# EAGLE design CoffeeRoaster_FrontPanelBoard_2023_02_25_A (EAGLE 9.6.1)
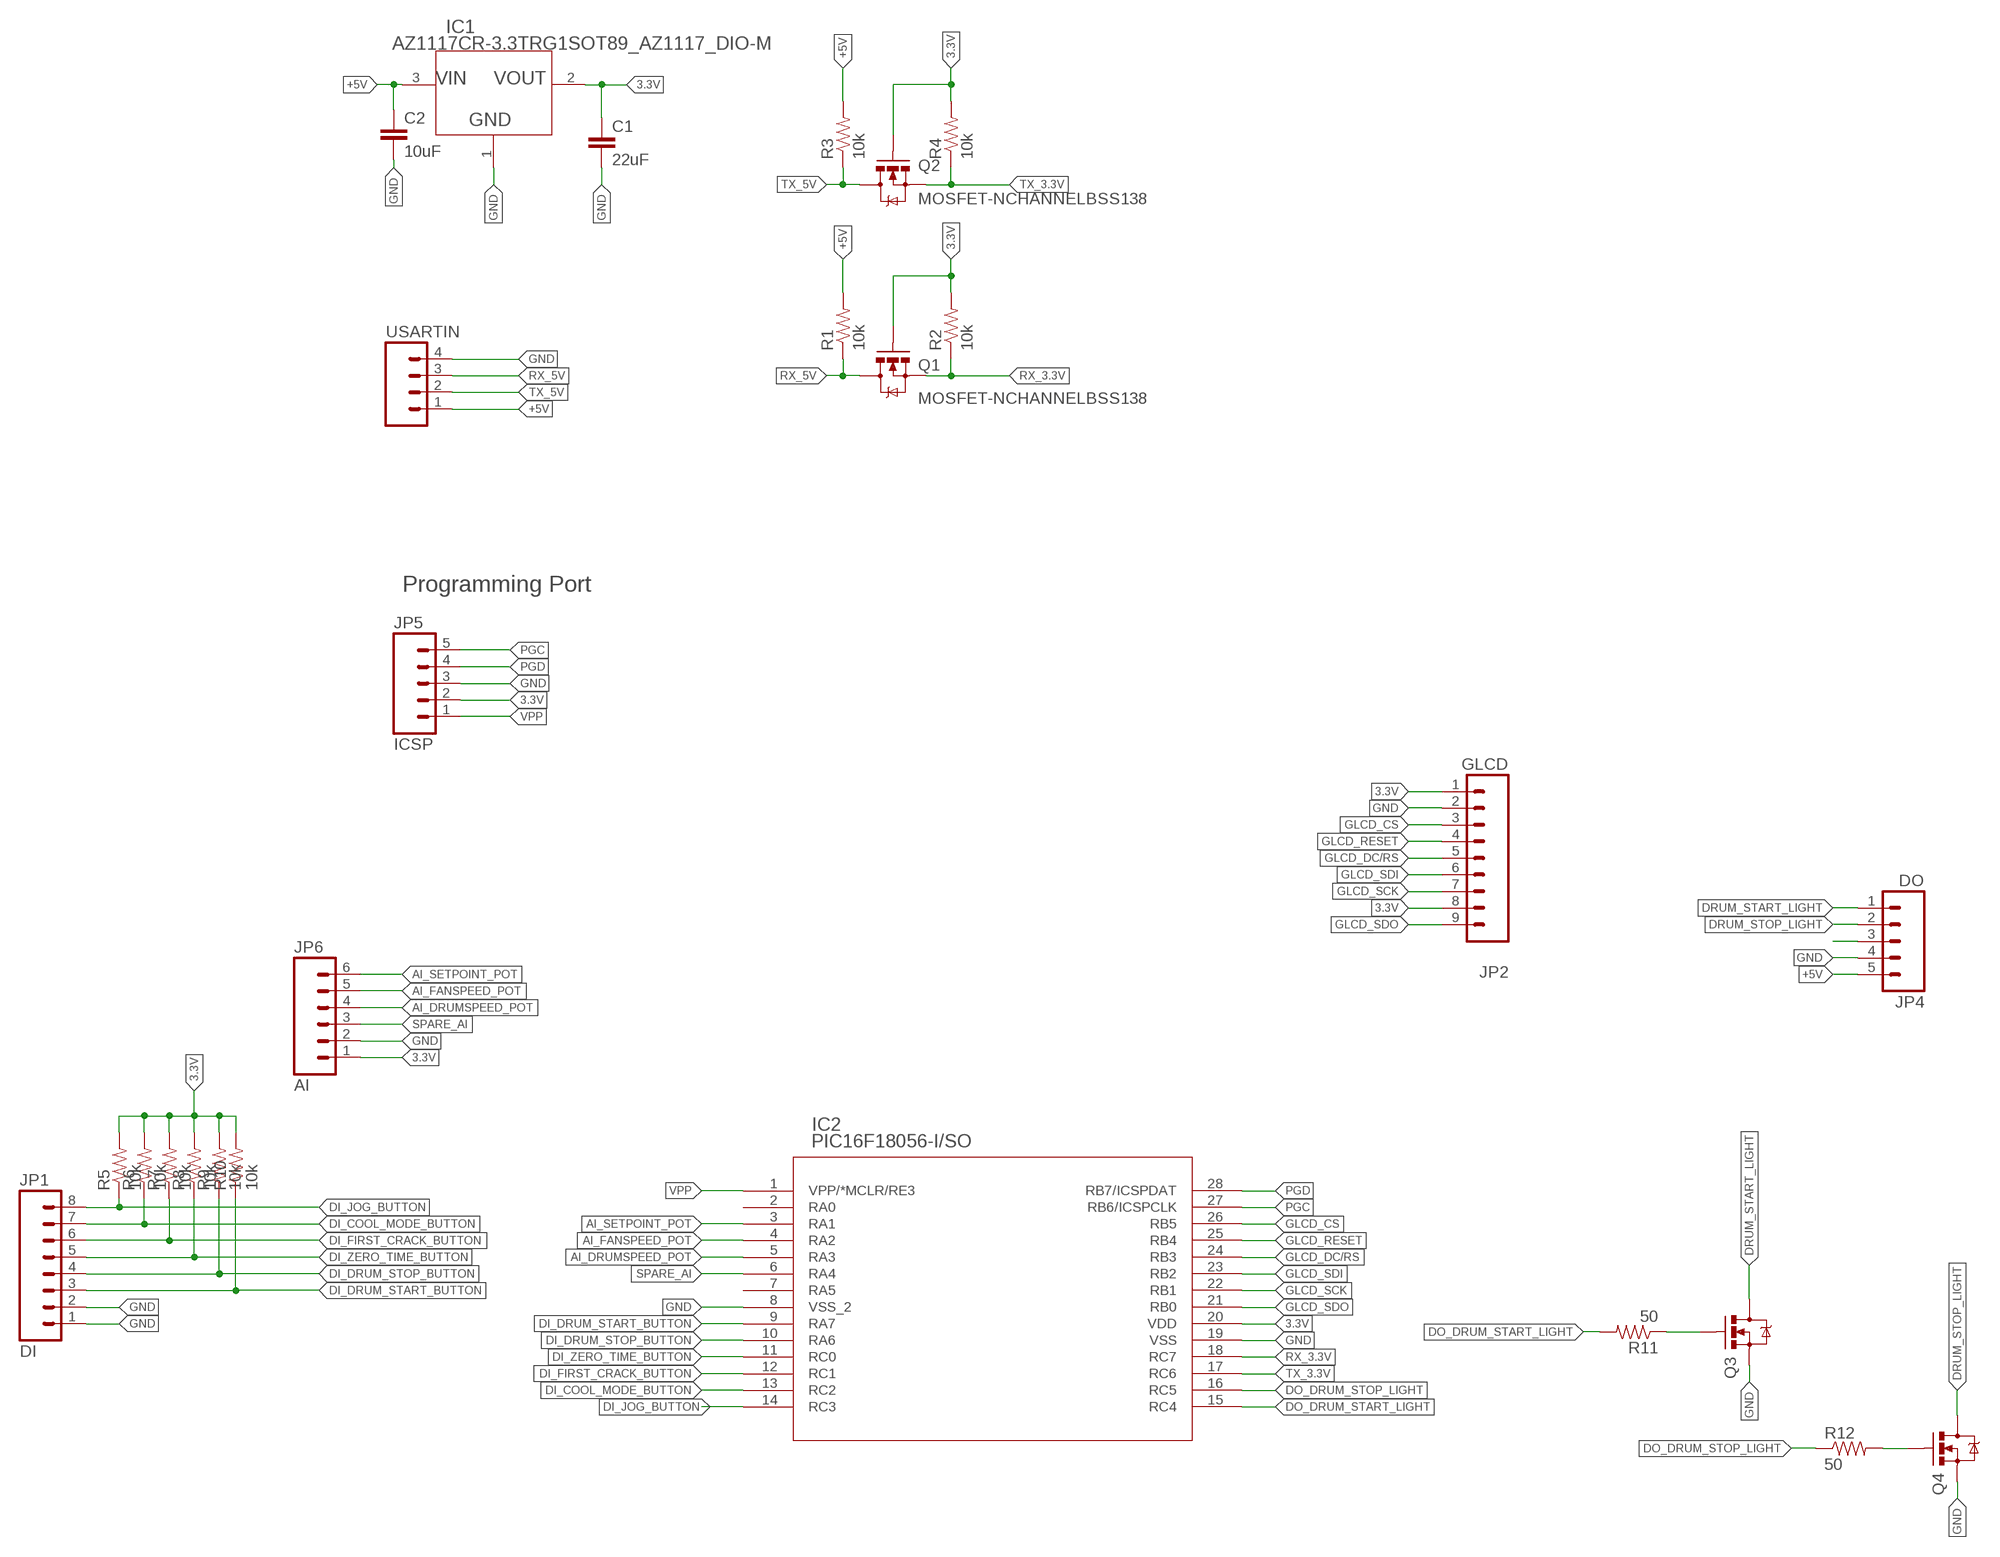
[diagram p0: schematic, sheet 1]

## Parts
C1  22uF  CAP1206  [1206]
C2  10uF  CAP1206  [1206]
IC1  AZ1117CR-3.3TRG1SOT89_AZ1117_DIO-M  [SOT89_AZ1117_DIO-M]
IC2  PIC16F18056-I/SO  PIC16F1773-X/SO  [SOIC28-W_MC]
JP1  DI  M08LOCK_LONGPADS  [1X08_LOCK_LONGPADS]
JP2  GLCD  M09LOCK-LONGPADS  [1X09_LOCK_LONGPADS]
JP4  DO  M05LOCK_LONGPADS  [1X05_LOCK_LONGPADS]
JP5  ICSP  M05PTH  [1X05]
JP6  AI  M06LOCK_LONGPADS  [1X06_LOCK_LONGPADS]
Q1  MOSFET-NCHANNELBSS138  [SOT23-3]
Q2  MOSFET-NCHANNELBSS138  [SOT23-3]
Q3  MOSFET-NCHANNELBSS138  [SOT23-3]
Q4  MOSFET-NCHANNELBSS138  [SOT23-3]
R1  10k  RESISTOR1206  [1206]
R2  10k  RESISTOR1206  [1206]
R3  10k  RESISTOR1206  [1206]
R4  10k  RESISTOR1206  [1206]
R5  10k  RESISTOR1206  [1206]
R6  10k  RESISTOR1206  [1206]
R7  10k  RESISTOR1206  [1206]
R8  10k  RESISTOR1206  [1206]
R9  10k  RESISTOR1206  [1206]
R10  10k  RESISTOR1206  [1206]
R11  50  RESISTOR1206  [1206]
R12  50  RESISTOR1206  [1206]
USARTIN  M04LONGPADS  [1X04_LONGPADS]

## Nets
3.3V: C1.1 IC1.2(OUTPUT) IC2.20(VDD) JP2.1 JP2.8 JP5.2 JP6.1 Q1.1(G) Q2.1(G) R2.2 R4.2 R5.2 R6.2 R7.2 R8.2 R9.2 R10.2
+5V: C2.1 IC1.3(INPUT) JP4.5 R1.2 R3.2 USARTIN.1
AI_DRUMSPEED_POT: IC2.5(RA3) JP6.4
AI_FANSPEED_POT: IC2.4(RA2) JP6.5
AI_SETPOINT_POT: IC2.3(RA1) JP6.6
DI_COOL_MODE_BUTTON: IC2.13(RC2) JP1.7 R6.1
DI_DRUM_START_BUTTON: IC2.9(RA7) JP1.3 R10.1
DI_DRUM_STOP_BUTTON: IC2.10(RA6) JP1.4 R9.1
DI_FIRST_CRACK_BUTTON: IC2.12(RC1) JP1.6 R7.1
DI_JOG_BUTTON: IC2.14(RC3) JP1.8 R5.1
DI_ZERO_TIME_BUTTON: IC2.11(RC0) JP1.5 R8.1
DO_DRUM_START_LIGHT: IC2.15(RC4) R11.2
DO_DRUM_STOP_LIGHT: IC2.16(RC5) R12.1
DRUM_START_LIGHT: JP4.1 Q3.3(D)
DRUM_STOP_LIGHT: JP4.2 Q4.3(D)
GLCD_CS: IC2.26(RB5) JP2.3
GLCD_DC/RS: IC2.24(RB3) JP2.5
GLCD_RESET: IC2.25(RB4) JP2.4
GLCD_SCK: IC2.22(RB1) JP2.7
GLCD_SDI: IC2.23(RB2) JP2.6
GLCD_SDO: IC2.21(RB0) JP2.9
GND: C1.2 C2.2 IC1.1(ADJ/GND) IC2.8(VSS_2) IC2.19(VSS) JP1.1 JP1.2 JP2.2 JP4.4 JP5.3 JP6.2 Q3.2(S) Q4.2(S) USARTIN.4
N$1: Q3.1(G) R11.1
N$2: Q4.1(G) R12.2
N$3: JP4.3
PGC: IC2.27(RB6/ICSPCLK) JP5.5
PGD: IC2.28(RB7/ICSPDAT) JP5.4
RX_3.3V: IC2.18(RC7) Q1.2(S) R2.1
RX_5V: Q1.3(D) R1.1 USARTIN.3
SPARE_AI: IC2.6(RA4) JP6.3
TX_3.3V: IC2.17(RC6) Q2.2(S) R4.1
TX_5V: Q2.3(D) R3.1 USARTIN.2
VPP: IC2.1(VPP/*MCLR/RE3) JP5.1
Unconnected: IC2.2(RA0) IC2.7(RA5)

## Notes on the sheet
- Programming Port

## Library data of the parts
C1 C2 = SparkFun-Capacitors:CAP: Capacitor Standard 0603 ceramic capacitor, and 0.1" leaded capacitor.
IC1 = AZ1117CR-3.3TRG1:AZ1117CR-3.3TRG1; COPYRIGHT: Copyright (C) 2022 Ultra Librarian. All rights reserved.; DIGI-KEY_PART_NUMBER_1: AZ1117CR-3.3TRG1DITR-ND; DIGI-KEY_PART_NUMBER_2: AZ1117CR-3.3TRG1DICT-ND; DIGI-KEY_PART_NUMBER_3: AZ1117CR-3.3TRG1DIDKR-ND; MANUFACTURER_PART_NUMBER: AZ1117CR-3.3TRG1; MFR_NAME: Diodes Inc
IC2 = PIC16F Series:PIC16F1773-X/SO; COPYRIGHT: Copyright (C) 2016 Accelerated Designs. All rights reserved; MANUFACTURER_PART_NUMBER: pic16f1773-x/so; VENDOR: Microchip
JP1 = SparkFun-Connectors:M08: Header 8 Standard 8-pin 0.1" header. Use with straight break away headers (SKU : PRT-00116), right angle break away headers (PRT-00553), swiss pins (PRT-00743), machine pins (PRT-00117), and female headers (PRT-00115).
JP2 = SparkFun-Connectors:M09: Header 9 Standard 9-pin 0.1" header. Use with straight break away headers (SKU : PRT-00116), right angle break away headers (PRT-00553), swiss pins (PRT-00743), machine pins (PRT-00117), and female headers (PRT-00115).
JP4 JP5 = SparkFun-Connectors:M05: Header 5 Standard 5-pin 0.1" header. Use with straight break away headers (SKU : PRT-00116), right angle break away headers (PRT-00553), swiss pins (PRT-00743), machine pins (PRT-00117), and female headers (PRT-00115). Molex polarized connector foot print use with SKU : PRT-08230 with associated crimp pins and housings.
JP6 = SparkFun-Connectors:M06: Header 6 Standard 6-pin 0.1" header. Use with straight break away headers (SKU : PRT-00116), right angle break away headers (PRT-00553), swiss pins (PRT-00743), machine pins (PRT-00117), and female headers (PRT-00115). Molex polarized connector foot print use with SKU : PRT-08094 with associated crimp pins and housings. NOTES ON THE VARIANTS LOCK and LOCK_LONGPADS... This footprint was designed to help hold the alignment of a through-hole component (i.e. 6-pin header) while soldering it into place. You may notice that each hole has been shifted either up or down by 0.005 of an inch from it's more standard position (which is a perfectly straight line). This slight alteration caused the pins (the squares in the middle) to touch the edges of the holes. Because they are alternating, it causes a "brace" to hold the component in place. 0.005 has proven to be the perfect amount of "off-center" position when using our standard breakaway headers. Although looks a little odd when you look at the bare footprint, once you have a header in there, the alteration is very hard to notice. Also,if you push a header all the way into place, it is covered up entirely on the bottom side. This idea of altering the position of holes to aid alignment will be further integrated into the Sparkfun Library for other footprints. It can help hold any component with 3 or more connection pins.
Q1-Q4 = SparkFun-DiscreteSemi:MOSFET-NCHANNEL: Common NMOSFET Parts MFG P/N Store ID Prod ID FDD8780 TRANS-09984 SI7820DN TRANS-11055 FDS6630A IC-08089 2N7002PW TRANS-11151 FQP30N06L COM-10213 TRANS-10060 BSS123LT1G TRANS-08345 BSS138 TRANS-00830 BS170 2N7000; PROD_ID: TRANS-00830
R1-R12 = SparkFun-Resistors:RESISTOR: Resistor Basic schematic elements and footprints for 0603, 1206, and PTH resistors.
USARTIN = SparkFun-Connectors:M04: Header 4 Standard 4-pin 0.1" header. Use with straight break away headers (SKU : PRT-00116), right angle break away headers (PRT-00553), swiss pins (PRT-00743), machine pins (PRT-00117), and female headers (PRT-00115). Molex polarized connector foot print use with SKU : PRT-08231 with associated crimp pins and housings. 1MM SMD Version SKU: PRT-10208

## Board
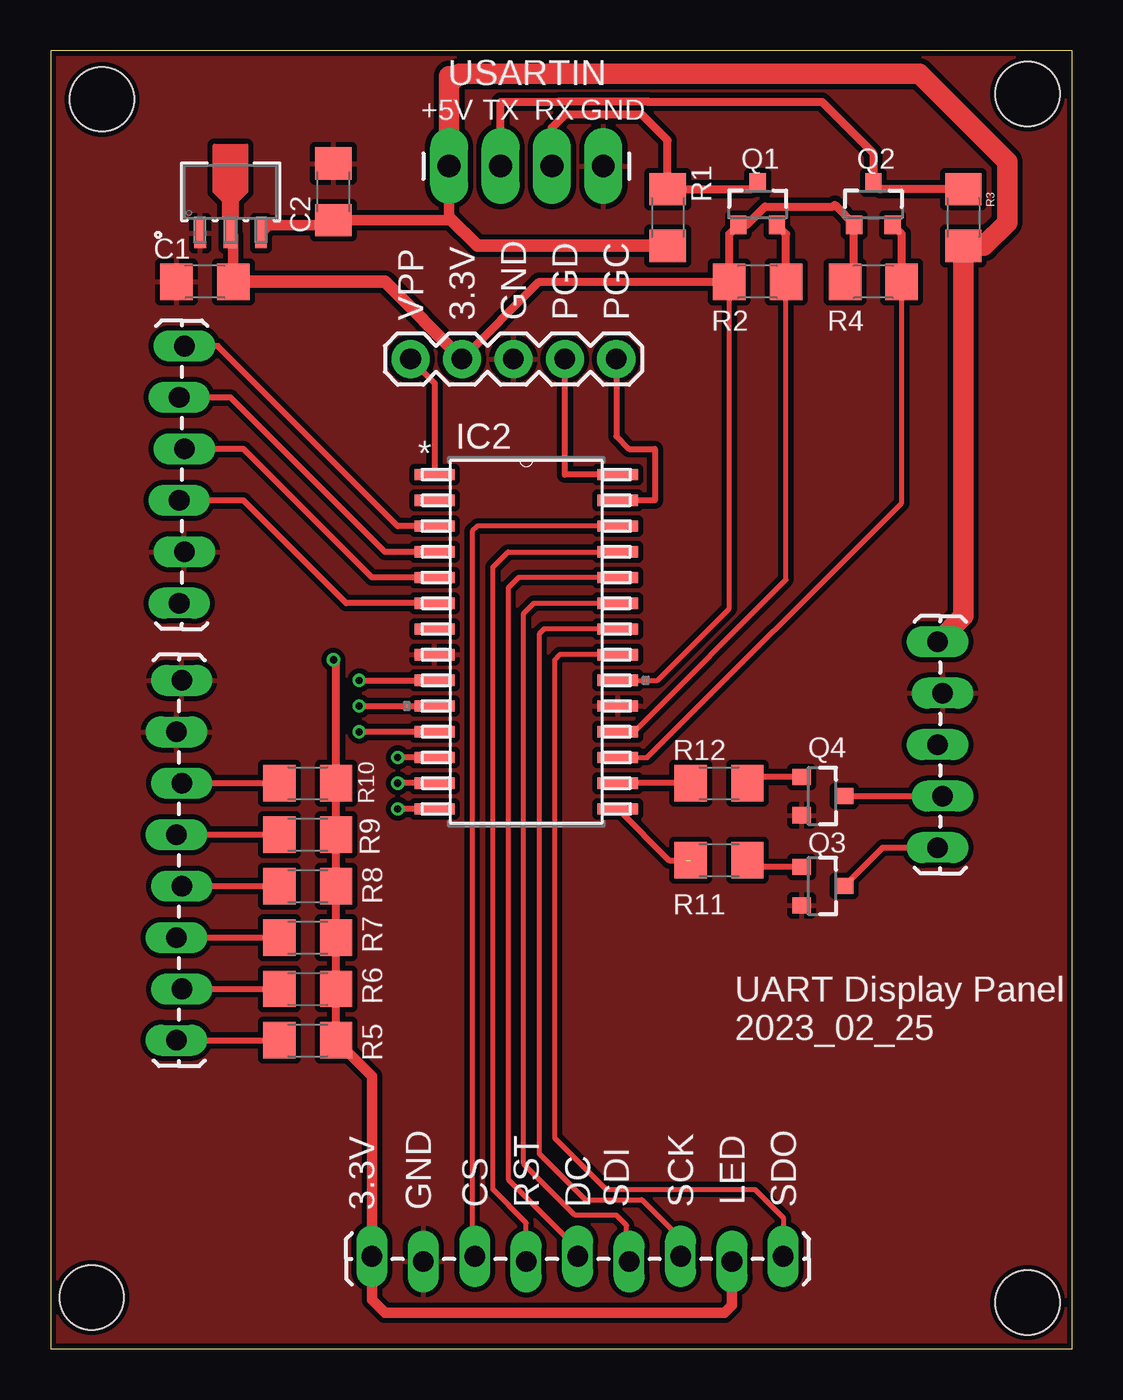
[diagram p1: board, top side]
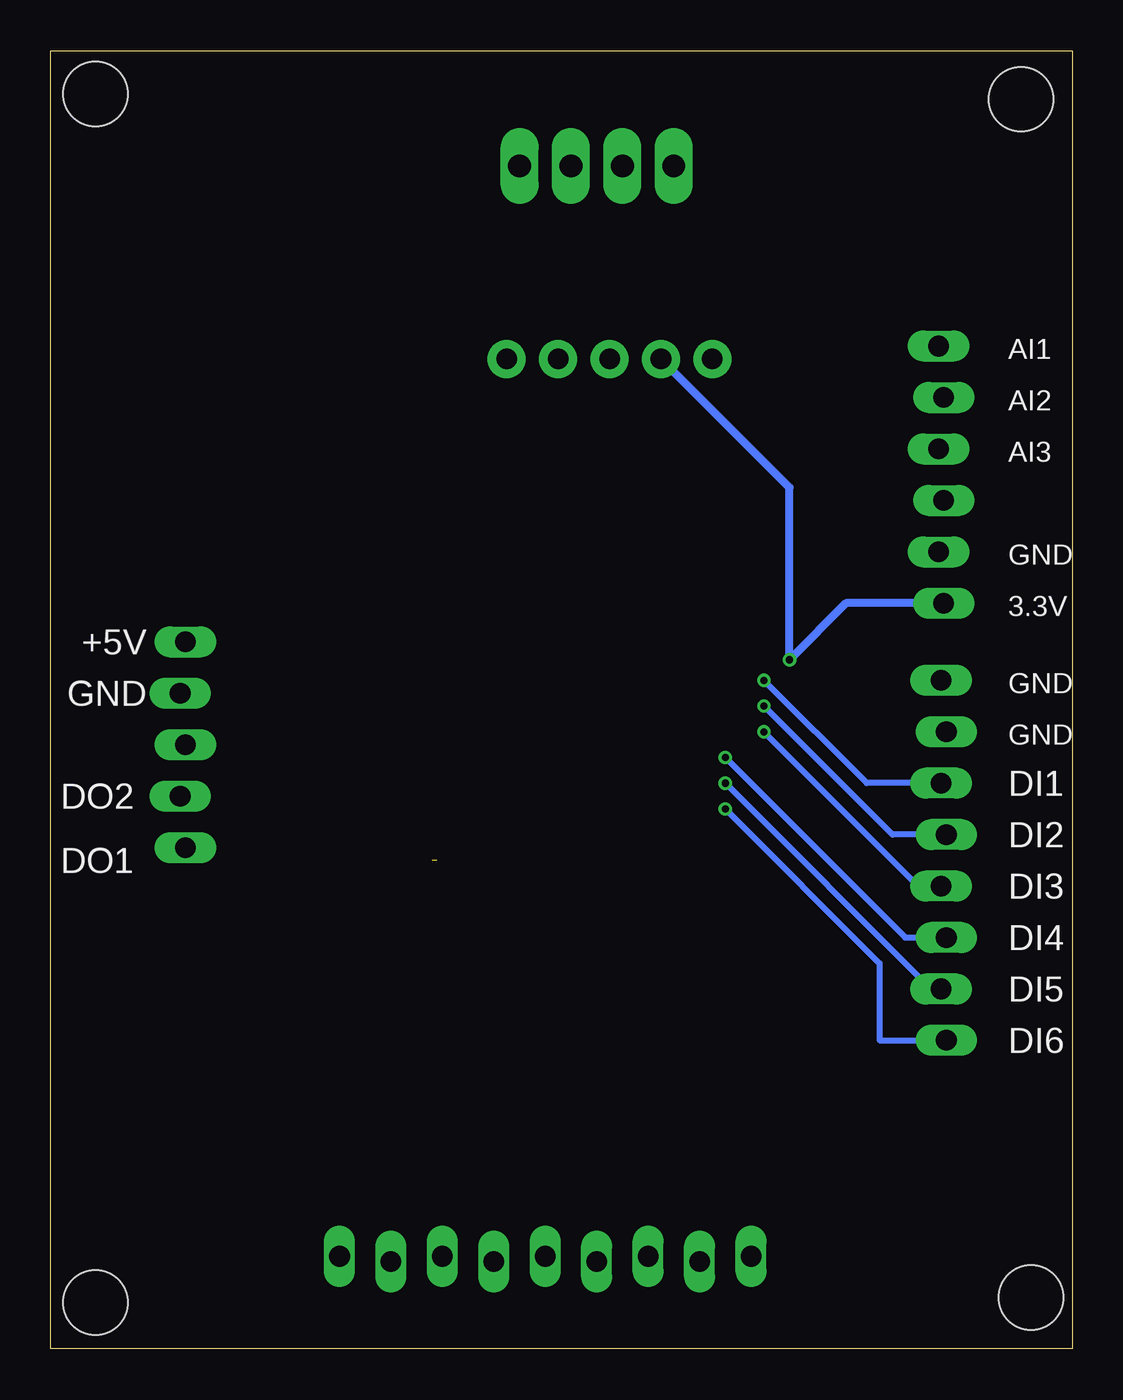
[diagram p2: board, bottom side, seen from below]

Size 50.47 x 64.12 mm. Coordinates in mm from the lower left corner, seen from the top.
Outline: 0,0 50.47,0 50.47,64.12 0,64.12 0,0
Copper layers (1*16): Top 0.035mm / dielectric 1.5mm / Bottom 0.035mm
Design rules "default": minimum track width 5mil, minimum drill 5mil, track to track 10mil, track to pad 10mil, pad to pad 10mil, via to via 10mil, smd to smd 6mil, copper to edge 10mil, drill to drill 6mil, minimum pad ring 6mil, minimum via ring 6mil, stop-mask expansion 4mil, vias tented up to drill 0mil, thermal gap 10mil
Holes 3.17 mm at 2.03,2.54 48.26,2.29 2.54,61.72 48.26,61.98

### Footprints (pad centres in the part's own frame; a part is rotated, then mirrored left to right if it is on the bottom)
1206 = smd 1.6 x 1.8: 1 -1.4,0; 2 1.4,0
SOT89_AZ1117_DIO-M = smd 0.584 x 1.499: 1 -1.5,-2.045; 3 1.5,-2.045 | smd 0.66 x 1.499: 2 0,-2.045
SOIC28-W_MC = smd 1.981 x 0.559: 1 -4.521,8.255; 2 -4.521,6.985; 3 -4.521,5.715; 4 -4.521,4.445; 5 -4.521,3.175; 6 -4.521,1.905; 7 -4.521,0.635; 8 -4.521,-0.635; 9 -4.521,-1.905; 10 -4.521,-3.175; 11 -4.521,-4.445; 12 -4.521,-5.715; 13 -4.521,-6.985; 14 -4.521,-8.255; 15 4.521,-8.255; 16 4.521,-6.985; 17 4.521,-5.715; 18 4.521,-4.445; 19 4.521,-3.175; 20 4.521,-1.905; 21 4.521,-0.635; 22 4.521,0.635; 23 4.521,1.905; 24 4.521,3.175; 25 4.521,4.445; 26 4.521,5.715; 27 4.521,6.985; 28 4.521,8.255
1X08_LOCK_LONGPADS = drill 1.016 long: 1 0,0.127; 2 2.54,-0.127; 3 5.08,0.127; 4 7.62,-0.127; 5 10.16,0.127; 6 12.7,-0.127; 7 15.24,0.127; 8 17.78,-0.127
1X09_LOCK_LONGPADS = drill 1.016 long: 1 0,0.127; 2 2.54,-0.127; 3 5.08,0.127; 4 7.62,-0.127; 5 10.16,0.127; 6 12.7,-0.127; 7 15.24,0.127; 8 17.78,-0.127; 9 20.32,0.127
1X05_LOCK_LONGPADS = drill 1.016 long: 1 0,0; 2 2.54,-0.254; 3 5.08,0; 4 7.62,-0.254; 5 10.16,0
1X05 = drill 1.016 pad 1.88: 1 0,0; 2 2.54,0; 3 5.08,0; 4 7.62,0; 5 10.16,0
1X06_LOCK_LONGPADS = drill 1.016 long: 1 0,0; 2 2.54,-0.254; 3 5.08,0; 4 7.62,-0.254; 5 10.16,0; 6 12.7,-0.254
SOT23-3 = smd 0.8 x 0.9: 1 -0.95,-1; 2 0.95,-1; 3 0,1.1
1X04_LONGPADS = drill 1.118 pad 1.88 long: 1 0,0; 2 2.54,0; 3 5.08,0; 4 7.62,0

### Placement (x,y rotation side)
C1  7.62,52.7 180 top
C2  13.97,57.15 90 top
IC1  8.89,57.15 0 top
IC2  23.5,34.92 0 top
JP1  6.35,33.02 270 top
JP2  15.87,4.45 0 top
JP4  43.81,24.77 90 top
JP5  17.78,48.89 0 top
JP6  6.35,36.83 90 top
Q1  34.92,56.52 0 top
Q2  40.64,56.52 0 top
Q3  38.1,22.86 270 top
Q4  38.1,27.3 270 top
R1  30.48,55.88 270 top
R2  34.92,52.7 180 top
R3  45.09,55.88 270 top
R4  40.64,52.7 180 top
R5  12.7,15.24 0 top
R6  12.7,17.78 0 top
R7  12.7,20.32 0 top
R8  12.7,22.86 0 top
R9  12.7,25.4 0 top
R10  12.7,27.94 0 top
R11  33.02,24.13 180 top
R12  33.02,27.94 0 top
USARTIN  19.68,58.42 0 top

### Tracks (layer width: path | path; a pad name or v marks a point on that pad's centre or on a via)
3.3V  (via drill 0.35)
  Top 0.254: IC2.20 29.97,33.02 33.53,36.58 33.53,53.34
  Top 0.406: R4.2 39.69,53.16 Q2.1 39.69,55.56 38.73,56.52 38.64,56.42 35.29,56.42 34.38,55.52 Q1.1 33.53,55.06 33.53,53.34 R2.2 24.13,52.7 JP5.2 | R5.2 R6.2 R7.2 R8.2 R9.2 R10.2 14.1,33.91 v13.97,34.04
  Top 0.508: IC1.2 9.02,54.97 C1.1 | R5.2 15.87,13.46 JP2.1 15.87,2.41 16.51,1.78 33.27,1.78 33.66,2.16 JP2.8
  Top 0.61: JP5.2 16.51,52.7 C1.1
  Bottom 0.406: JP5.2 13.97,42.54 v13.97,34.04 11.18,36.83 JP6.1
+5V
  Top 0.508: IC1.3 10.78,55.5 13.72,55.5 C2.1 19.55,55.75 19.68,55.88 USARTIN.1
  Top 0.61: R1.2 21.08,54.48 19.68,55.88
  Top 1.016: JP4.5 45.09,36.2 R3.2 46.1,54.48 47.26,55.63 47.26,58.65 42.91,62.99 20.19,62.99 19.68,62.48 | 19.68,62.86 19.68,62.48 | 19.68,62.48 USARTIN.1
AI_DRUMSPEED_POT
  Top 0.305: IC2.5 15.87,38.1 9.52,44.45 JP6.4
AI_FANSPEED_POT
  Top 0.305: IC2.4 16.51,39.37 8.89,46.99 JP6.5
AI_SETPOINT_POT
  Top 0.305: IC2.3 17.14,40.64 8.25,49.53 JP6.6
DI_COOL_MODE_BUTTON  (via drill 0.35)
  Top 0.305: JP1.7 R6.1 | IC2.13 v17.14,27.94
  Bottom 0.305: v17.14,27.94 6.98,17.78 JP1.7
DI_DRUM_START_BUTTON  (via drill 0.35)
  Top 0.305: JP1.3 R10.1 | v15.24,33.02 IC2.9
  Bottom 0.305: JP1.3 10.16,27.94 v15.24,33.02
DI_DRUM_STOP_BUTTON  (via drill 0.35)
  Top 0.305: JP1.4 R9.1 | v15.24,31.75 IC2.10
  Bottom 0.305: JP1.4 8.89,25.4 v15.24,31.75
DI_FIRST_CRACK_BUTTON  (via drill 0.35)
  Top 0.305: JP1.6 R7.1 | IC2.12 v17.14,29.21
  Bottom 0.305: v17.14,29.21 8.25,20.32 JP1.6
DI_JOG_BUTTON  (via drill 0.35)
  Top 0.305: JP1.8 R5.1 | IC2.14 v17.14,26.67
  Bottom 0.305: v17.14,26.67 9.52,19.05 9.52,15.24 JP1.8
DI_ZERO_TIME_BUTTON  (via drill 0.35)
  Top 0.305: JP1.5 R8.1 | IC2.11 v15.24,30.48
  Bottom 0.305: JP1.5 7.62,22.86 v15.24,30.48
DO_DRUM_START_LIGHT  (1 unrouted)
  Top 0.305: IC2.15 30.56,24.13 31.37,24.13
DO_DRUM_STOP_LIGHT
  Top 0.305: R12.1 IC2.16
DRUM_START_LIGHT
  Top 0.305: Q3.3 41.11,24.77 JP4.1
DRUM_STOP_LIGHT
  Top 0.305: Q4.3 JP4.2
GLCD_CS
  Top 0.254: IC2.26 21.08,40.64 20.83,40.39 20.83,4.7 JP2.3
GLCD_DC/RS
  Top 0.254: IC2.24 23.11,38.1 22.61,37.59 22.61,8.38 26.04,4.95 JP2.5
GLCD_RESET
  Top 0.254: JP2.4 23.5,6.22 21.84,7.87 21.84,38.61 22.61,39.37 IC2.25
GLCD_SCK
  Top 0.254: IC2.22 24.38,35.56 24.13,35.31 24.13,9.65 26.42,7.37 29.21,7.37 31.11,5.46 JP2.7
GLCD_SDI
  Top 0.254: JP2.6 28.45,4.45 28.45,6.1 27.94,6.6 25.91,6.6 23.37,9.14 23.37,36.32 23.88,36.83 IC2.23
GLCD_SDO
  Top 0.254: IC2.21 25.15,34.29 24.89,34.04 24.89,10.41 27.43,7.87 34.8,7.87 36.19,6.48 JP2.9
GND
  pour Top: 0,64.13 52.07,64.13 52.7,63.5 52.7,0 50.17,-2.54 -2.54,-2.54 -2.54,61.59
N$1
  Top 0.305: Q3.1 34.74,23.81 R11.1
N$2
  Top 0.305: Q4.1 34.73,28.25 R12.2
PGC
  Top 0.305: JP5.5 27.94,45.09 28.57,44.45 29.85,44.45 29.85,41.91 IC2.27
PGD
  Top 0.305: IC2.28 25.4,43.18 JP5.4
RX_3.3V
  Top 0.254: IC2.18 28.81,30.48 36.33,38 36.33,52.83
  Top 0.406: R2.1 36.33,52.83 36.33,55.06 Q1.2
RX_5V
  Top 0.406: USARTIN.3 24.76,60.33 25.4,60.96 29.21,60.96 30.48,59.69 R1.1 34.59,57.28 Q1.3
SPARE_AI
  Top 0.305: JP6.3 9.52,41.91 14.61,36.83 IC2.6
TX_3.3V
  Top 0.254: IC2.17 29.46,29.21 42.04,41.79 R4.1
  Top 0.406: R4.1 42.04,55.06 Q2.2
TX_5V
  Top 0.406: USARTIN.2 22.22,61.59 25.1,61.59 25.13,61.62 29.48,61.62 29.51,61.59 38.1,61.59 40.64,59.05 Q2.3 40.97,57.28 R3.1
VPP
  Top 0.305: JP5.1 18.97,47.7 IC2.1

### Text on the board
tPlace: UART Display Panel / 2023_02_25 | 3.3V | GND | LED
tNames: +5V | TX | RX | GND | VPP | 3.3V | GND | PGD | PGC | CS | RST | DC | SDI | SCK | SDO
bNames: AI1 | AI2 | AI3 | GND | 3.3V | +5V | GND | GND | GND | DO2 | DI1 | DI2 | DO1 | DI3 | DI4 | DI5 | DI6